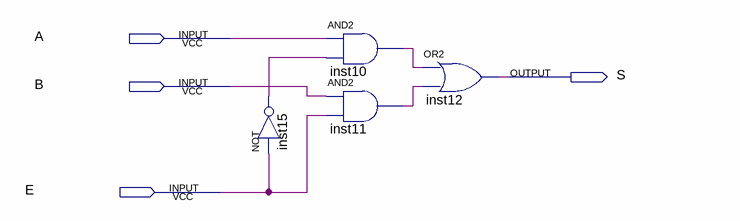
[diagram p0: schematic sheet]
// Quartus schematic mux2.bdf as structural Verilog: 4 symbols, 4 pins
module mux2 (
  input  A,
  input  B,
  input  E,
  output S
);

  wire inst10_out, inst11_out, inst15_out;

  not inst15 (inst15_out, E);
  and inst10 (inst10_out, A, inst15_out);
  and inst11 (inst11_out, B, E);
  or inst12 (S, inst10_out, inst11_out);
endmodule
